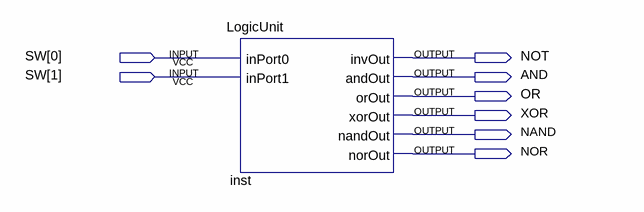
[diagram p0: schematic sheet]
// Quartus schematic LogicDemo1.bdf as structural Verilog: 1 symbols, 8 pins
module LogicDemo1 (
  input  [1:0] SW,
  output NOT,
  output AND,
  output OR,
  output XOR,
  output NAND,
  output NOR
);

  LogicUnit inst (
    .inPort0(SW[0]), .inPort1(SW[1]), .invOut(NOT), .andOut(AND), .orOut(OR), .xorOut(XOR), .nandOut(NAND),
    .norOut(NOR));
endmodule
